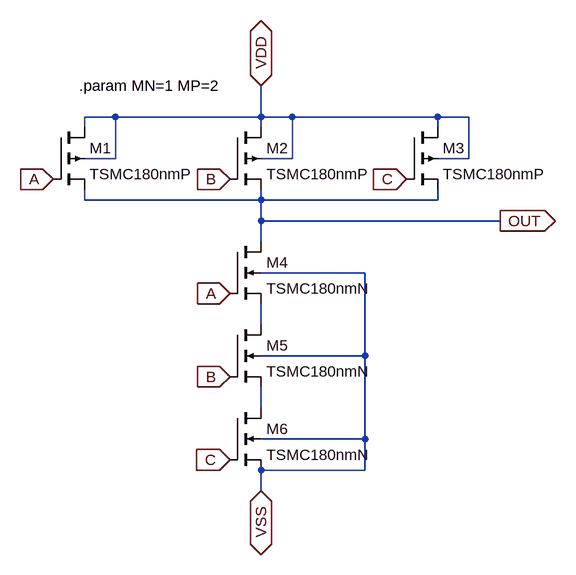
[diagram p0: schematic NAND3.asc]
NAND3.asc, the LTspice schematic file:
Version 4
SHEET 1 1052 744
WIRE 352 64 304 64
WIRE 576 64 576 16
WIRE 576 64 352 64
WIRE 624 64 576 64
WIRE 848 64 624 64
WIRE 896 64 848 64
WIRE 304 80 304 64
WIRE 576 80 576 64
WIRE 848 80 848 64
WIRE 352 128 352 64
WIRE 352 128 304 128
WIRE 624 128 624 64
WIRE 624 128 576 128
WIRE 896 128 896 64
WIRE 896 128 848 128
WIRE 304 192 304 176
WIRE 576 192 576 176
WIRE 576 192 304 192
WIRE 848 192 848 176
WIRE 848 192 576 192
WIRE 576 224 576 192
WIRE 944 224 576 224
WIRE 576 256 576 224
WIRE 736 304 576 304
WIRE 576 384 576 352
WIRE 736 432 736 304
WIRE 736 432 576 432
WIRE 576 512 576 480
WIRE 736 560 736 432
WIRE 736 560 576 560
WIRE 736 608 736 560
WIRE 736 608 576 608
WIRE 576 640 576 608
FLAG 256 160 A
IOPIN 256 160 In
FLAG 944 224 OUT
IOPIN 944 224 Out
FLAG 576 640 VSS
IOPIN 576 640 BiDir
FLAG 576 16 VDD
IOPIN 576 16 BiDir
FLAG 528 160 B
IOPIN 528 160 In
FLAG 800 160 C
IOPIN 800 160 In
FLAG 528 336 A
IOPIN 528 336 In
FLAG 528 464 B
IOPIN 528 464 In
FLAG 528 592 C
IOPIN 528 592 In
SYMBOL nmos4 528 256 R0
SYMATTR InstName M4
SYMATTR Value TSMC180nmN
SYMATTR Value2 l=200nm w=1200nm ad=0 as=0 pd=0 ps=0 m={MN}
SYMBOL pmos4 256 80 R0
SYMATTR InstName M1
SYMATTR Value TSMC180nmP
SYMATTR Value2 l=200nm w=1200nm ad=0 as=0 pd=0 ps=0 m={MP}
SYMBOL pmos4 528 80 R0
SYMATTR InstName M2
SYMATTR Value TSMC180nmP
SYMATTR Value2 l=200nm w=1200nm ad=0 as=0 pd=0 ps=0 m={MP}
SYMBOL pmos4 800 80 R0
SYMATTR InstName M3
SYMATTR Value TSMC180nmP
SYMATTR Value2 l=200nm w=1200nm ad=0 as=0 pd=0 ps=0 m={MP}
SYMBOL nmos4 528 384 R0
SYMATTR InstName M5
SYMATTR Value TSMC180nmN
SYMATTR Value2 l=200nm w=1200nm ad=0 as=0 pd=0 ps=0 m={MN}
SYMBOL nmos4 528 512 R0
SYMATTR InstName M6
SYMATTR Value TSMC180nmN
SYMATTR Value2 l=200nm w=1200nm ad=0 as=0 pd=0 ps=0 m={MN}
TEXT 296 16 Left 2 !.param MN=1 MP=2

The netlist it stands for:
* NAND3.asc
M4 OUT A N001 VSS TSMC180nmN l=200nm w=1200nm ad=0 as=0 pd=0 ps=0 m={MN}
M1 VDD A OUT VDD TSMC180nmP l=200nm w=1200nm ad=0 as=0 pd=0 ps=0 m={MP}
M2 VDD B OUT VDD TSMC180nmP l=200nm w=1200nm ad=0 as=0 pd=0 ps=0 m={MP}
M3 VDD C OUT VDD TSMC180nmP l=200nm w=1200nm ad=0 as=0 pd=0 ps=0 m={MP}
M5 N001 B N002 VSS TSMC180nmN l=200nm w=1200nm ad=0 as=0 pd=0 ps=0 m={MN}
M6 N002 C VSS VSS TSMC180nmN l=200nm w=1200nm ad=0 as=0 pd=0 ps=0 m={MN}
.model NMOS NMOS
.model PMOS PMOS
.lib standard.mos
.param MN=1 MP=2
.backanno
.end